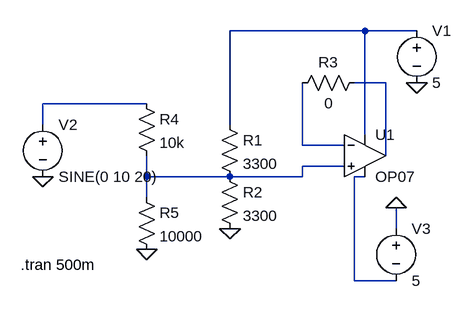
[diagram p0: schematic analog in.asc]
analog in.asc, the LTspice schematic file:
Version 4
SHEET 1 880 680
WIRE 208 -80 0 -80
WIRE 288 -80 208 -80
WIRE 240 0 192 0
WIRE -128 32 -288 32
WIRE -288 64 -288 32
WIRE 0 64 0 -80
WIRE 208 80 208 -80
WIRE 112 96 112 0
WIRE 176 96 112 96
WIRE 240 112 240 0
WIRE 176 128 112 128
WIRE -128 144 -128 112
WIRE 0 144 -128 144
WIRE 112 144 112 128
WIRE 112 144 0 144
WIRE 208 144 192 144
WIRE -128 176 -128 144
WIRE 256 224 256 192
WIRE 192 304 192 144
WIRE 256 304 192 304
FLAG 288 0 0
FLAG -288 144 0
FLAG -128 256 0
FLAG 256 192 0
FLAG 0 224 0
SYMBOL OpAmps\\OP07 208 48 R0
SYMATTR InstName U1
SYMBOL voltage 288 -96 R0
WINDOW 123 0 0 Left 0
WINDOW 39 0 0 Left 0
SYMATTR InstName V1
SYMATTR Value 5
SYMBOL voltage -288 48 R0
WINDOW 123 0 0 Left 0
WINDOW 39 0 0 Left 0
SYMATTR InstName V2
SYMATTR Value SINE(0 10 20)
SYMBOL res 208 -16 R90
WINDOW 0 0 56 VBottom 2
WINDOW 3 32 56 VTop 2
SYMATTR InstName R3
SYMATTR Value 0
SYMBOL res -144 16 R0
SYMATTR InstName R4
SYMATTR Value 10k
SYMBOL res -144 160 R0
SYMATTR InstName R5
SYMATTR Value 10000
SYMBOL voltage 256 208 R0
WINDOW 123 0 0 Left 0
WINDOW 39 0 0 Left 0
SYMATTR InstName V3
SYMATTR Value 5
SYMBOL res -16 48 R0
SYMATTR InstName R1
SYMATTR Value 3300
SYMBOL res -16 128 R0
SYMATTR InstName R2
SYMATTR Value 3300
TEXT -322 280 Left 2 !.tran 500m

The netlist it stands for:
* analog in.asc
XU1 N005 N004 N001 N006 N002 LT1001  ; OP07, pins In+ In- V+ V- OUT
V1 N001 0 5
V2 N003 0 SINE(0 10 20)
R3 N002 N004 0
R4 N003 N005 10k
R5 N005 0 10000
V3 0 N006 5
R1 N001 N005 3300
R2 N005 0 3300
.tran 500m
.lib LTC.lib
.backanno
.end